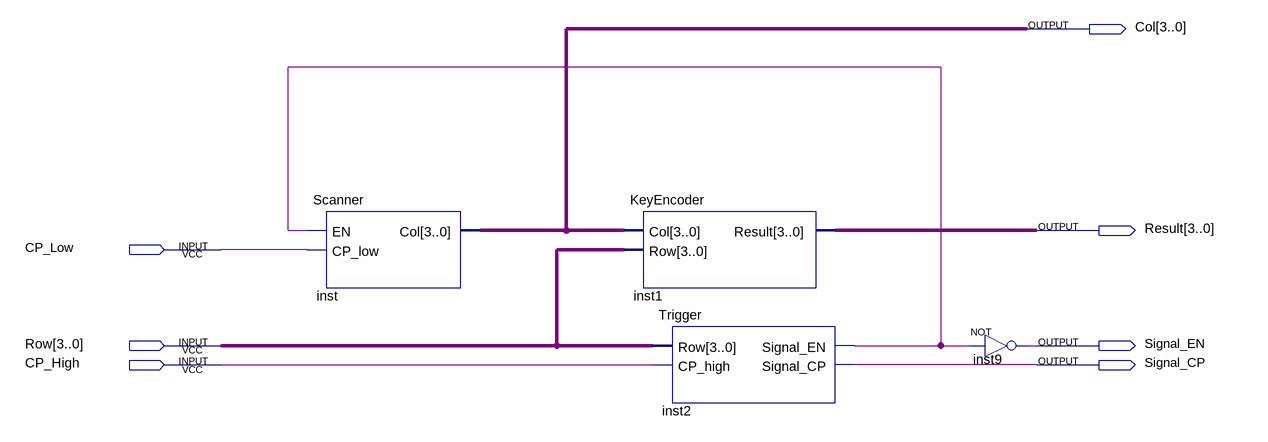
[diagram p0: schematic sheet]
// Quartus schematic MatrixKeyBoard.bdf as structural Verilog: 4 symbols, 7 pins
module MatrixKeyBoard (
  input  CP_Low,
  input  [3:0] Row,
  input  CP_High,
  output [3:0] Col,
  output [3:0] Result,
  output Signal_EN,
  output Signal_CP
);

  wire inst2_signal_en;

  Scanner inst (.EN(inst2_signal_en), .CP_low(CP_Low), .Col(Col));
  KeyEncoder inst1 (.Col(Col), .Row(Row), .Result(Result));
  Trigger inst2 (.Row(Row), .CP_high(CP_High), .Signal_EN(inst2_signal_en), .Signal_CP(Signal_CP));
  not inst9 (Signal_EN, inst2_signal_en);
endmodule
